# Altium schematic sheet Power Diagram.SchDoc
size A; SheetNumber: 18; SheetTotal: 18
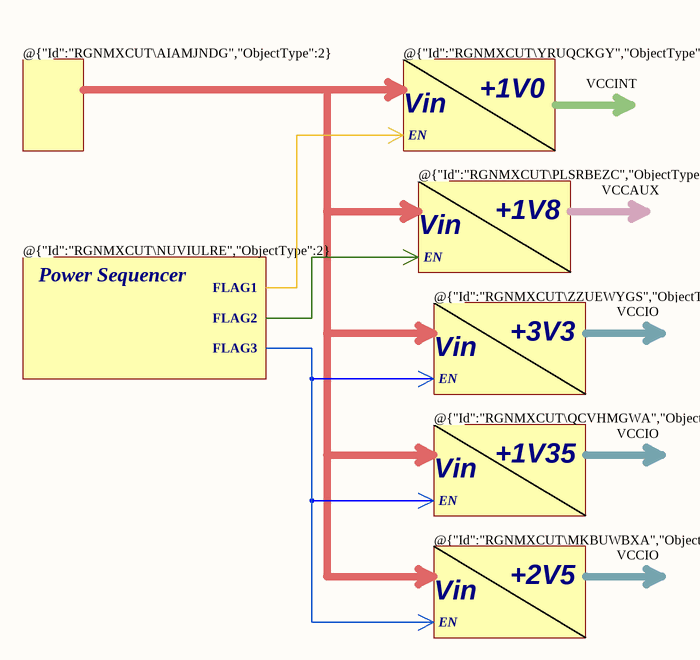
[diagram p0: Power Diagram.SchDoc]

## Notes on the sheet
- @{"Id":"RGNMXCUT\AIAMJNDG","ObjectType":2}
- @{"Id":"RGNMXCUT\YRUQCKGY","ObjectType":2}
- +1V0
- VCCINT
- Vin
- @{"Id":"RGNMXCUT\PLSRBEZC","ObjectType":2}
- EN
- @{"Id":"RGNMXCUT\NUVIULRE","ObjectType":2}
- +1V8
- VCCAUX
- Power Sequencer
- FLAG1
- FLAG2
- @{"Id":"RGNMXCUT\ZZUEWYGS","ObjectType":2}
- VCCIO
- FLAG3
- +3V3
- @{"Id":"RGNMXCUT\QCVHMGWA","ObjectType":2}
- +1V35
- @{"Id":"RGNMXCUT\MKBUWBXA","ObjectType":2}
- +2V5